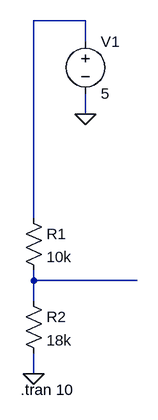
[diagram p0: schematic Draft1.asc]
Draft1.asc, the LTspice schematic file:
Version 4
SHEET 1 880 680
WIRE 192 -256 112 -256
WIRE 192 -224 192 -256
WIRE 192 -112 192 -144
WIRE 112 48 112 -256
WIRE 112 144 112 128
WIRE 272 144 112 144
WIRE 112 176 112 144
WIRE 112 288 112 256
FLAG 112 288 0
FLAG 192 -112 0
SYMBOL res 96 32 R0
SYMATTR InstName R1
SYMATTR Value 10k
SYMBOL res 96 160 R0
SYMATTR InstName R2
SYMATTR Value 18k
SYMBOL voltage 192 -240 R0
WINDOW 123 0 0 Left 0
WINDOW 39 0 0 Left 0
SYMATTR InstName V1
SYMATTR Value 5
TEXT 92 312 Left 2 !.tran 10

The netlist it stands for:
* Draft1.asc
R1 N001 N002 10k
R2 N002 0 18k
V1 N001 0 5
.tran 10
.backanno
.end